# EAGLE design HeadBoard (EAGLE 9.4.2)
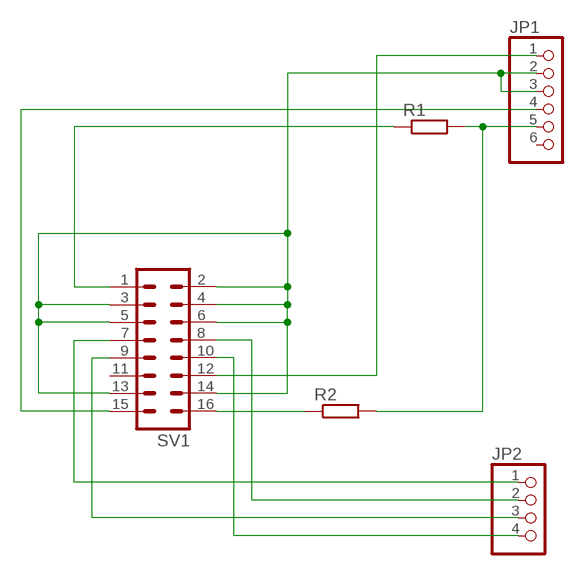
[diagram p0: schematic, sheet 1]

## Parts
JP1  PINHD-1X6  [1X06]
JP2  PINHD-1X4  [1X04]
R1  R_R0805  [RESC2012X50]
R2  R_R0805  [RESC2012X50]
SV1  ML16  [ML16]

## Nets
N$1: JP2.1 SV1.7
N$2: JP2.2 SV1.8
N$3: JP2.3 SV1.9
N$4: JP2.4 SV1.10
N$5: JP1.1 SV1.12
N$6: JP1.2 JP1.3 SV1.2 SV1.3 SV1.4 SV1.5 SV1.6 SV1.13 SV1.14
N$7: JP1.4 SV1.15
N$8: JP1.5 R1.2 R2.2
N$9: R1.1 SV1.1
N$10: R2.1 SV1.16
Unconnected: JP1.6 SV1.11

## Library data of the parts
JP1 = pinhead:PINHD-1X6: PIN HEADER
JP2 = pinhead:PINHD-1X4: PIN HEADER
R1 R2 = Flamberm:R_
SV1 = con-ml:ML16: HARTING; OC_FARNELL: unknown; OC_NEWARK: unknown

## Board
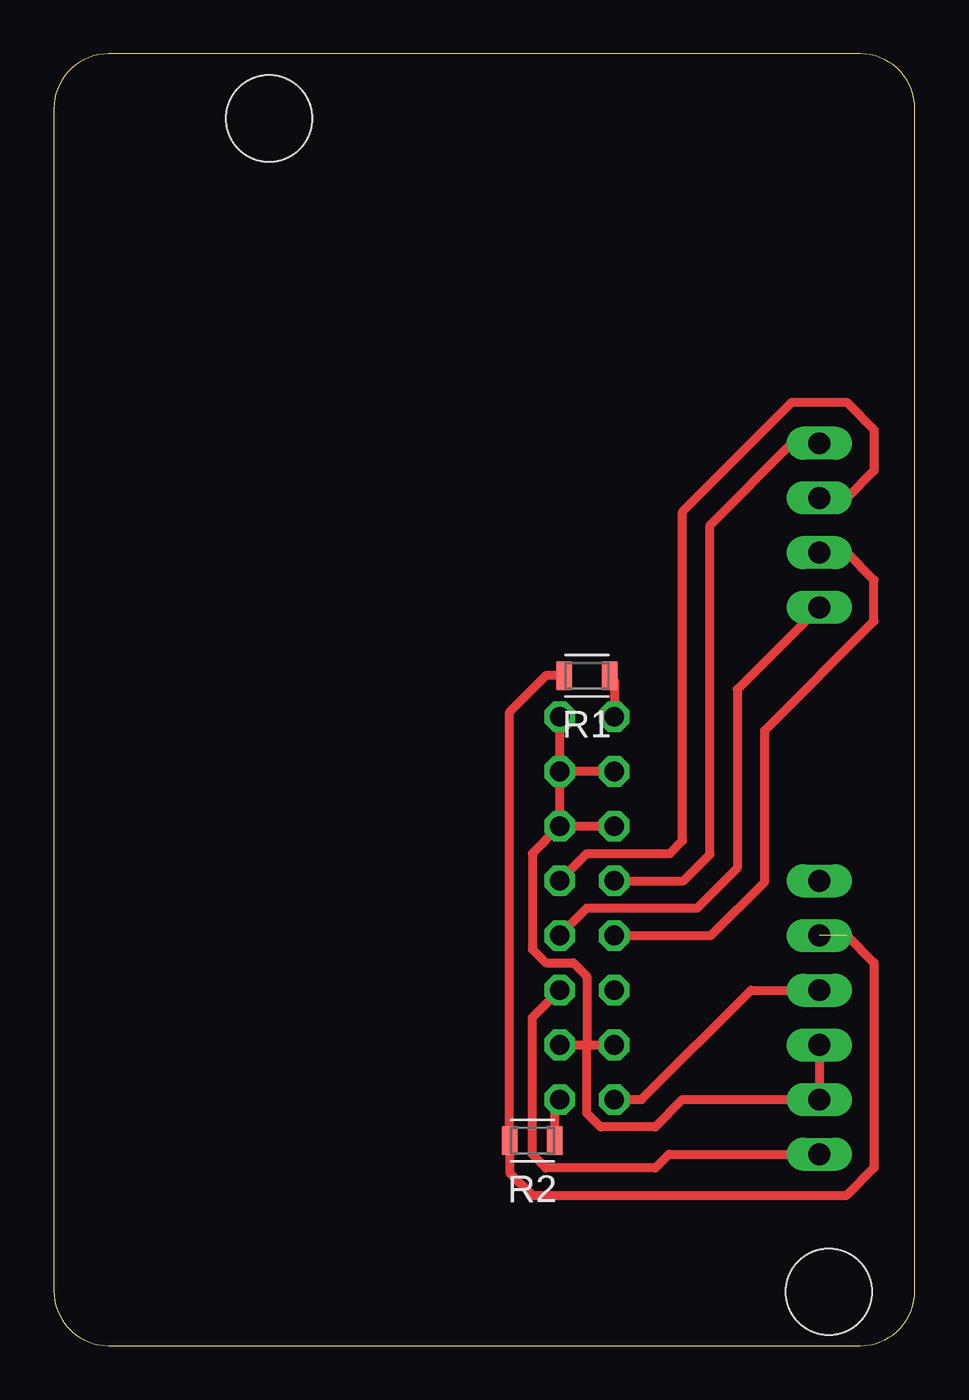
[diagram p1: board, top side]
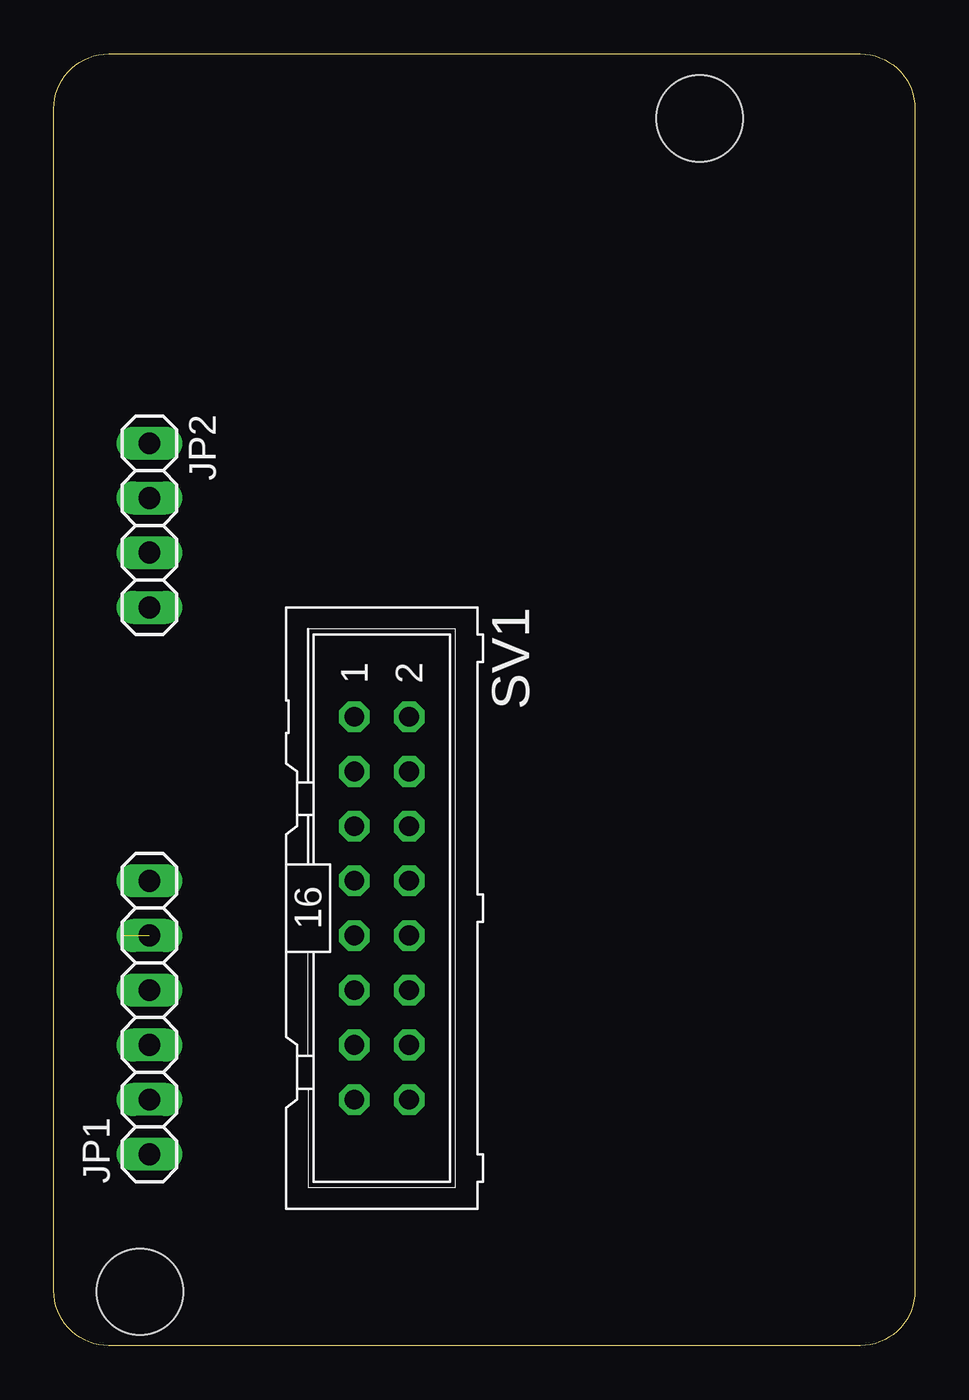
[diagram p2: board, bottom side, seen from below]

Size 40 x 60 mm. Coordinates in mm from the lower left corner, seen from the top.
Outline: 40,2.54 40,57.46 arc90 37.46,60 2.54,60 arc90 0,57.46 0,2.54 arc90 2.54,0 37.46,0 arc90 40,2.54
Copper layers (1*16): Top 0.035mm / dielectric 1.5mm / Bottom 0.035mm
Design rules "default": minimum track width 6mil, minimum drill 0.35mm, track to track 6mil, track to pad 6mil, pad to pad 6mil, via to via 6mil, smd to smd 6mil, copper to edge 40mil, drill to drill 6mil, minimum pad ring 10mil, minimum via ring 8mil, stop-mask expansion 4mil, vias tented up to drill 0mil, thermal gap 10mil
Holes 4 mm at 36,2.5 10,57

### Footprints (pad centres in the part's own frame; a part is rotated, then mirrored left to right if it is on the bottom)
1X06 = drill 1.016 long: 1 -6.35,0; 2 -3.81,0; 3 -1.27,0; 4 1.27,0; 5 3.81,0; 6 6.35,0
1X04 = drill 1.016 long: 1 -3.81,0; 2 -1.27,0; 3 1.27,0; 4 3.81,0
RESC2012X50 = smd 0.712 x 1.312: 1 -1.05,0; 2 1.05,0
ML16 = drill 0.914 octagon: 1 -8.89,-1.27; 2 -8.89,1.27; 3 -6.35,-1.27; 4 -6.35,1.27; 5 -3.81,-1.27; 6 -3.81,1.27; 7 -1.27,-1.27; 8 -1.27,1.27; 9 1.27,-1.27; 10 1.27,1.27; 11 3.81,-1.27; 12 3.81,1.27; 13 6.35,-1.27; 14 6.35,1.27; 15 8.89,-1.27; 16 8.89,1.27

### Placement (x,y rotation side)
JP1  35.56,15.24 90 bottom
JP2  35.56,38.1 270 bottom
R1  24.77,31.11 180 top
R2  22.23,9.53 180 top
SV1  24.77,20.32 270 bottom

### Tracks (layer width: path | path; a pad name or v marks a point on that pad's centre or on a via)
N$1
  Top 0.406: SV1.7 29.25,21.59 30.48,22.82 30.48,38.1 34.29,41.91 JP2.1
N$2
  Top 0.406: SV1.8 24.77,22.86 28.61,22.86 29.21,23.45 29.21,38.73 34.29,43.81 36.83,43.81 38.1,42.55 38.1,40.64 36.83,39.37 JP2.2
N$3
  Top 0.406: SV1.9 30.52,19.05 33.02,21.55 33.02,28.57 38.1,33.66 38.1,35.56 36.83,36.83 JP2.3
N$4
  Top 0.406: SV1.10 24.77,20.32 29.89,20.32 31.75,22.18 31.75,30.48 JP2.4
N$5
  Top 0.406: SV1.12 22.23,15.24 22.23,8.89 22.86,8.26 27.94,8.26 28.57,8.89 JP1.1
N$6
  Top 0.406: SV1.14 24.77,13.97 | 24.77,13.97 SV1.13 | 24.77,13.97 24.77,10.79 25.4,10.16 27.94,10.16 29.21,11.43 JP1.2 JP1.3 | SV1.2 SV1.4 | SV1.3 SV1.4 | SV1.4 SV1.6 | SV1.6 SV1.5 | SV1.6 22.23,22.86 22.23,18.41 22.86,17.78 24.13,17.78 24.77,17.14 24.77,13.97
N$7
  Top 0.406: SV1.15 27.3,11.43 32.38,16.51 JP1.4
N$8  (1 unrouted)
  Top 0.406: 36.83,19.05 38.1,17.78 38.1,8.26 36.83,6.99 22.23,6.99 21.18,8.04 R2.2 21.18,29.43 22.86,31.11 R1.2
N$9
  Top 0.406: R1.1 26.04,30.89 SV1.1
N$10
  Top 0.406: R2.1 23.27,11.21 SV1.16